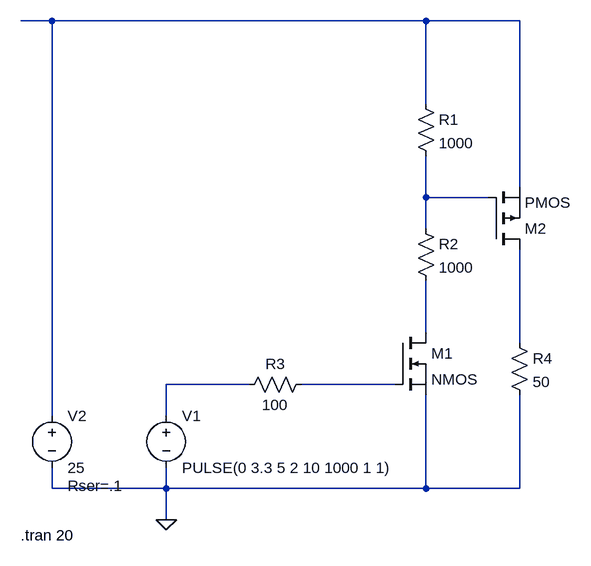
[diagram p0: schematic HighSideSwitch.asc]
HighSideSwitch.asc, the LTspice schematic file:
Version 4
SHEET 1 880 680
WIRE -384 -480 -432 -480
WIRE 192 -480 -384 -480
WIRE 336 -480 192 -480
WIRE 192 -352 192 -480
WIRE 336 -224 336 -480
WIRE 192 -208 192 -272
WIRE 288 -208 192 -208
WIRE 192 -160 192 -208
WIRE 192 0 192 -80
WIRE 336 16 336 -128
WIRE -80 80 -208 80
WIRE 144 80 0 80
WIRE -384 128 -384 -480
WIRE -208 128 -208 80
WIRE -384 240 -384 208
WIRE -208 240 -208 208
WIRE -208 240 -384 240
WIRE 192 240 192 96
WIRE 192 240 -208 240
WIRE 336 240 336 96
WIRE 336 240 192 240
WIRE -208 288 -208 240
FLAG -208 288 0
SYMBOL voltage -208 112 R0
WINDOW 123 0 0 Left 0
WINDOW 39 0 0 Left 0
SYMATTR InstName V1
SYMATTR Value PULSE(0 3.3 5 2 10 1000 1 1)
SYMBOL nmos 144 0 R0
SYMATTR InstName M1
SYMBOL pmos 288 -128 M180
SYMATTR InstName M2
SYMBOL res 176 -368 R0
SYMATTR InstName R1
SYMATTR Value 1000
SYMBOL res 176 -176 R0
SYMATTR InstName R2
SYMATTR Value 1000
SYMBOL voltage -384 112 R0
WINDOW 123 0 0 Left 0
WINDOW 39 24 124 Left 2
SYMATTR InstName V2
SYMATTR Value 25
SYMATTR SpiceLine Rser=.1
SYMBOL res 16 64 R90
WINDOW 0 0 56 VBottom 2
WINDOW 3 32 56 VTop 2
SYMATTR InstName R3
SYMATTR Value 100
SYMBOL res 320 0 R0
SYMATTR InstName R4
SYMATTR Value 50
TEXT -432 312 Left 2 !.tran 20

The netlist it stands for:
* HighSideSwitch.asc
V1 N005 0 PULSE(0 3.3 5 2 10 1000 1 1)
M1 N003 N006 0 0 NMOS
M2 N004 N002 N001 N001 PMOS
R1 N001 N002 1000
R2 N002 N003 1000
V2 N001 0 25 Rser=.1
R3 N006 N005 100
R4 N004 0 50
.model NMOS NMOS
.model PMOS PMOS
.lib standard.mos
.tran 20
.backanno
.end